# EasyEDA schematic serverpowersuply.json

## Sheets
1 powerlayout: TITLE: Sheet_1; REV: 1.0; Date: 2022-03-16; Sheet: 1/1; Drawn By: Michael1.; Company: Your Company
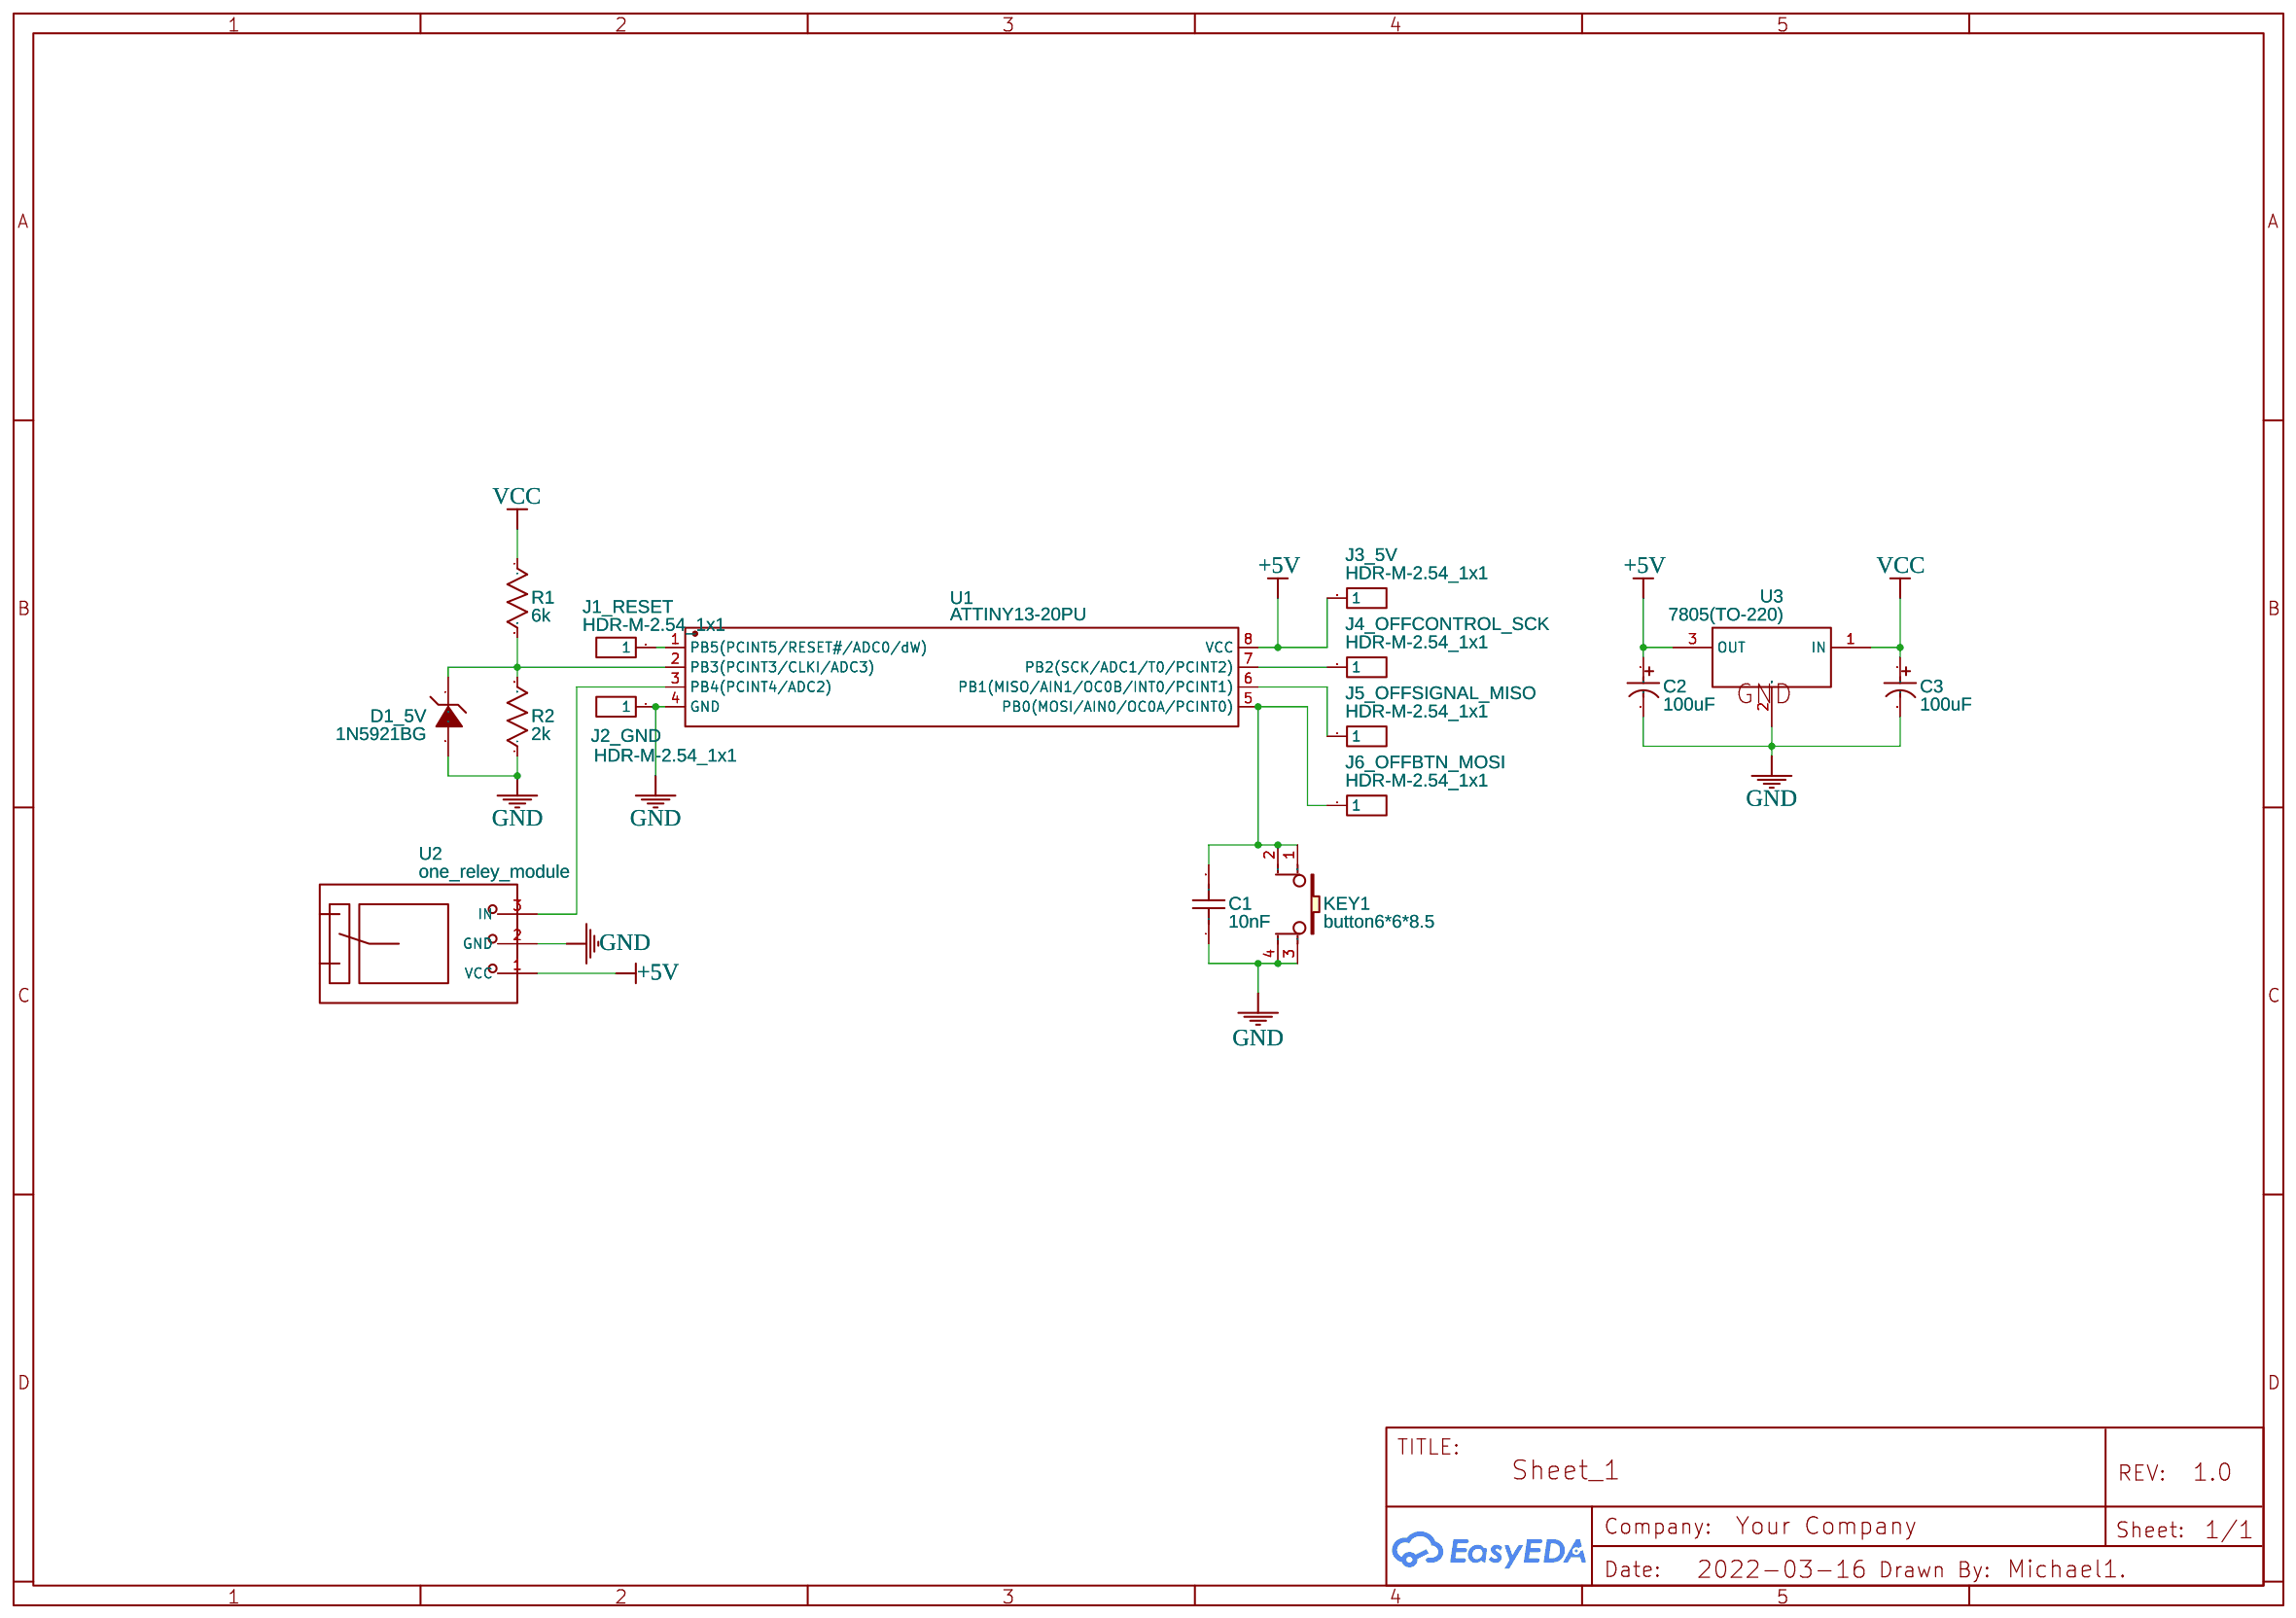
[diagram p0: powerlayout]
2 power2: Date: 2022-03-20
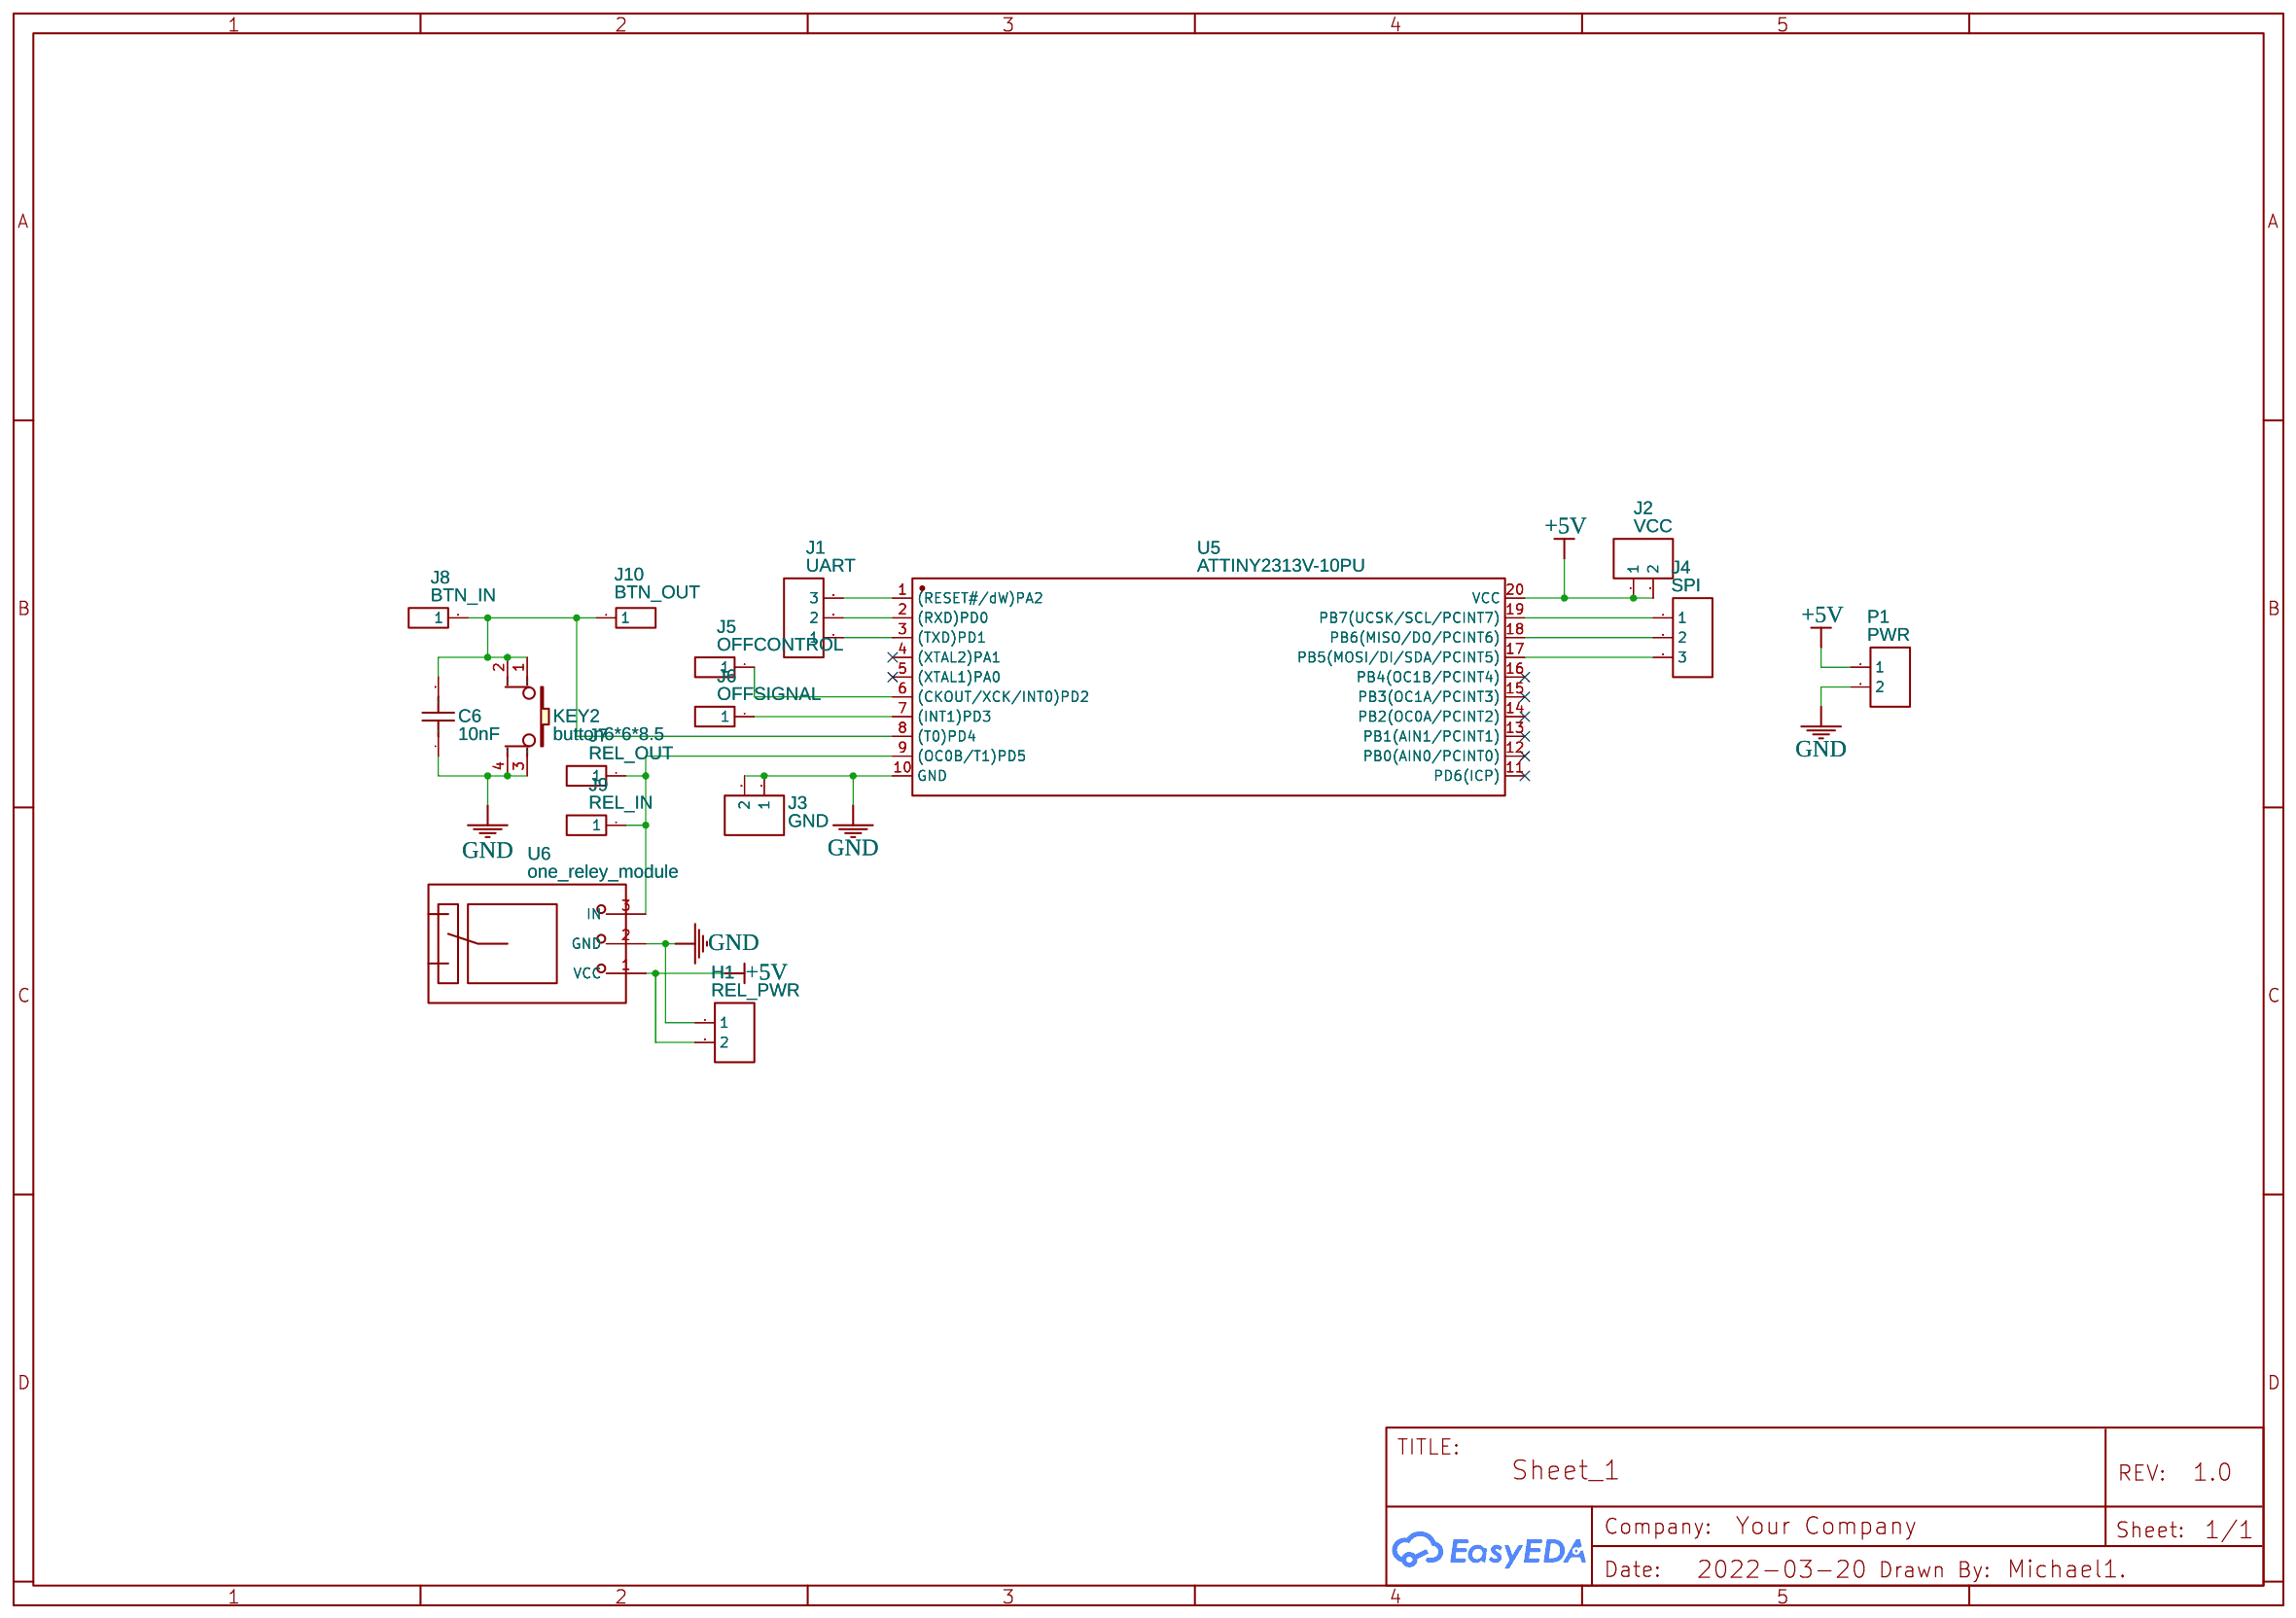
[diagram p1: power2]

## Parts
sheet power2
C6  10nF  [CAP-TH_L4.2-W3.8-P5.08-D0.6]
H1  REL_PWR  [HDR-F-2.54_1X2]
J1  UART  [HDR-M-2.54_1X3]
J2  VCC  [HDR-M-2.54_1X2]
J3  GND  [HDR-M-2.54_1X2]
J4  SPI  [HDR-M-2.54_1X3]
J5  OFFCONTROL  [HDR-M-2.54_1X1]
J6  OFFSIGNAL  [HDR-M-2.54_1X1]
J7  REL_OUT  [HDR-M-2.54_1X1]
J8  BTN_IN  [HDR-M-2.54_1X1]
J9  REL_IN  [HDR-M-2.54_1X1]
J10  BTN_OUT  [HDR-M-2.54_1X1]
KEY2  button6*6*8.5  [KEY-TH_4P-L6.0-W6.0-P4.50]
P1  PWR  [CONN-TH_2P-P5.00]
U5  ATTINY2313V-10PU  [PDIP-20_L25.9-W6.6-P2.54-LS7.9-BL]
U6  one_reley_module  [ONE_RELEY_MODULE]
sheet powerlayout
C1  10nF  [CAP-TH_L4.2-W3.8-P5.08-D0.6]
C2  100uF  [CAP-TH_BD6.3-P2.50-D1.0-FD]
C3  100uF  [CAP-TH_BD6.3-P2.50-D1.0-FD]
D1_5V  1N5921BG  [DO-41_BD2.4-L4.7-P8.70-D0.9-RD]
J1_RESET  HDR-M-2.54_1x1  [HDR-M-2.54_1X1]
J2_GND  HDR-M-2.54_1x1  [HDR-M-2.54_1X1]
J3_5V  HDR-M-2.54_1x1  [HDR-M-2.54_1X1]
J4_OFFCONTROL_SCK  HDR-M-2.54_1x1  [HDR-M-2.54_1X1]
J5_OFFSIGNAL_MISO  HDR-M-2.54_1x1  [HDR-M-2.54_1X1]
J6_OFFBTN_MOSI  HDR-M-2.54_1x1  [HDR-M-2.54_1X1]
KEY1  button6*6*8.5  [KEY-TH_4P-L6.0-W6.0-P4.50]
R1  6k  [R_AXIAL-0.4]
R2  2k  [R_AXIAL-0.4]
U1  ATTINY13-20PU  [DIP-8_L9.2-W6.4-P2.54-LS8.7-BL]
U2  one_reley_module  [ONE_RELEY_MODULE]
U3  7805(TO-220)  [TO-220-3_L10.0-W4.5-P2.54-L]

## Library data of the parts
C1 C6 = CT4-0805Y103 M500: Supplier: LCSC; Manufacturer: ReliaPro; Supplier Part: C3766
H1 = HDR-F-2.54_1x2: Supplier Part: C49661; Supplier: LCSC; Contributor: LCEDA_Lib
J1 J4 = HDR-M-2.54_1x3: Supplier Part: C180248; Supplier: LCSC; Contributor: LCEDA_Lib
J2 J3 = HDR-M-2.54_1x2: Supplier Part: C124375; Supplier: LCSC; Contributor: LCEDA_Lib
J1_RESET J2_GND J3_5V J4_OFFCONTROL_SCK J5 J5_OFFSIGNAL_MISO J6 J6_OFFBTN_MOSI J7-J10 = HDR-M-2.54_1x1: Supplier Part: C81276; Supplier: LCSC; Contributor: LCEDA_Lib
KEY1 KEY2 = button6*6*8.5: Supplier Part: C59980; Supplier: LCSC; Manufacturer: ReliaPro
P1 = CONN-TH_2P-P5.00: Supplier: LCSC; Contributor: LCEDA_Lib
U5 = ATTINY2313V-10PU: Supplier: LCSC; Supplier Part: C613485; Manufacturer: MICROCHIP(美国微芯); Contributor: LCSC
U2 U6 = one_reley_module: Contributor: Michael1.
C2 C3 = 100uF 25V 6.3*7: Supplier: LCSC; Manufacturer: ValuePro; Supplier Part: C44587; JLCPCB Part Class: Extended Part
D1_5V = 1N5921BG: Supplier: LCSC; Supplier Part: C232466; Manufacturer: ON Semicon; Contributor: LCSC; JLCPCB Part Class: Extended Part
R1 R2 = R_AXIAL-0.4_US: Contributor: LCEDA_Lib
U1 = ATTINY13-20PU: Supplier: LCSC; Manufacturer: MICROCHIP; Contributor: Michael1.; Supplier Part: C145757; JLCPCB Part Class: Extended Part
U3 = 7805(TO-220): Supplier: LCSC; Manufacturer: STMicroelectronics; Manufacturer Part: L7805CV-DG; Supplier Part: C3795; Contributor: LCEDA_Lib

## Nets
+5V: C2.1 H1.2 J2.1 J2.2 J3_5V.1 P1.1 U1.8(VCC) U2.1(VCC) U3.3(OUT) U5.20(VCC) U6.1(VCC)
GND: C1.1 C2.2 C3.2 C6.1 D1_5V.2(A) H1.1 J2_GND.1 J3.1 J3.2 KEY1.3 KEY1.4 KEY2.3 KEY2.4 P1.2 R2.1 U1.4(GND) U2.2(GND) U3.2(GND) U5.10(GND) U6.2(GND)
VCC: C3.1 R1.1 U3.1(IN)
Net-(C1-2): C1.2 J6_OFFBTN_MOSI.1 KEY1.1 KEY1.2 U1.5(PB0(MOSI/AIN0/OC0A/PCINT0))
Net-(C6-2): C6.2 J8.1 J10.1 KEY2.1 KEY2.2 U5.8((T0)PD4)
Net-(D1_5V-1): D1_5V.1(C) R1.2 R2.2 U1.2(PB3(PCINT3/CLKI/ADC3))
Net-(J1-1): J1.1 U5.3((TXD)PD1)
Net-(J1-2): J1.2 U5.2((RXD)PD0)
Net-(J1-3): J1.3 U5.1((RESET#/dW)PA2)
Net-(J1_RESET-1): J1_RESET.1 U1.1(PB5(PCINT5/RESET#/ADC0/dW))
Net-(J4-1): J4.1 U5.19(PB7(UCSK/SCL/PCINT7))
Net-(J4-2): J4.2 U5.18(PB6(MISO/DO/PCINT6))
Net-(J4-3): J4.3 U5.17(PB5(MOSI/DI/SDA/PCINT5))
Net-(J4_OFFCONTROL_SCK-1): J4_OFFCONTROL_SCK.1 U1.7(PB2(SCK/ADC1/T0/PCINT2))
Net-(J5-1): J5.1 U5.6((CKOUT/XCK/INT0)PD2)
Net-(J5_OFFSIGNAL_MISO-1): J5_OFFSIGNAL_MISO.1 U1.6(PB1(MISO/AIN1/OC0B/INT0/PCINT1))
Net-(J6-1): J6.1 U5.7((INT1)PD3)
Net-(J7-1): J7.1 J9.1 U5.9((OC0B/T1)PD5) U6.3(IN)
Net-(U1-3): U1.3(PB4(PCINT4/ADC2)) U2.3(IN)

Not connected (* = marked no-connect by the designer): U5 4((XTAL2)PA1)* 5((XTAL1)PA0)* 11(PD6(ICP))* 12(PB0(AIN0/PCINT0))* 13(PB1(AIN1/PCINT1))* 14(PB2(OC0A/PCINT2))* 15(PB3(OC1A/PCINT3))* 16(PB4(OC1B/PCINT4))*
